# EAGLE schematic Driver_Breakout (EAGLE 7.2.0)
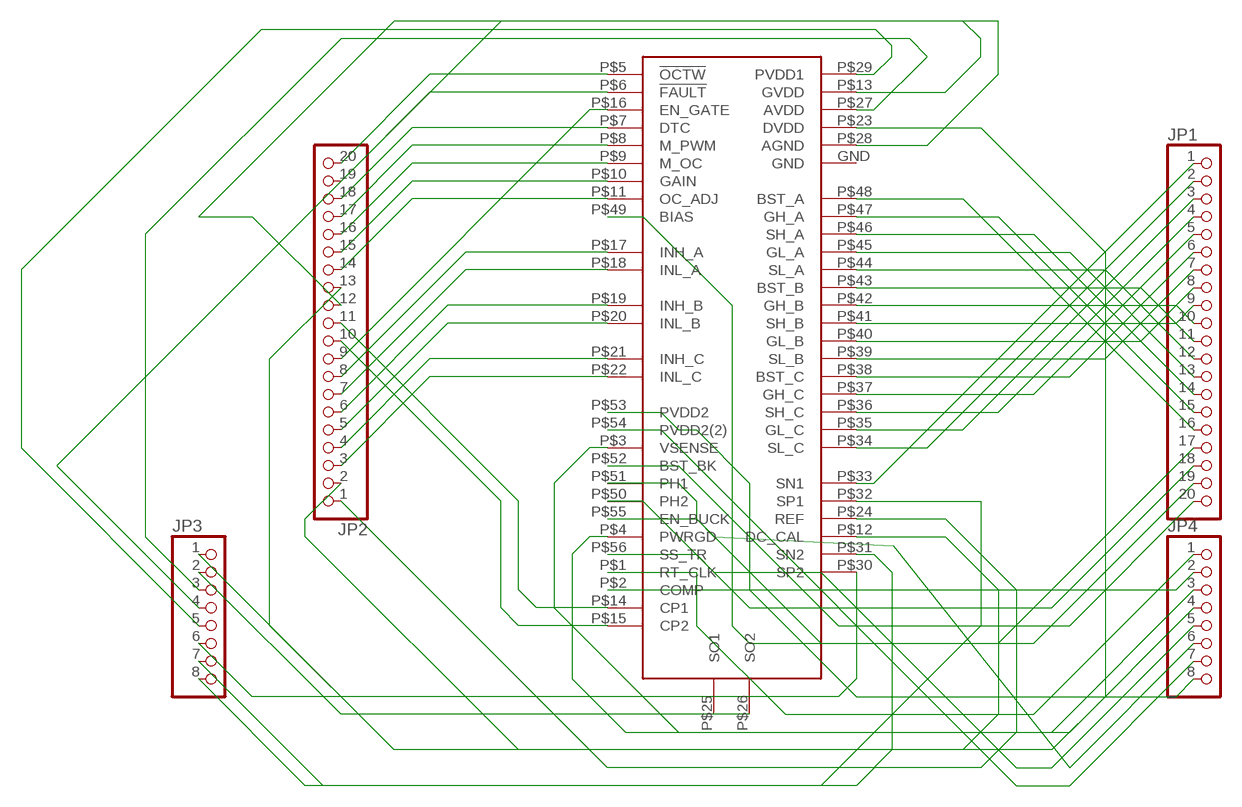
[diagram p0: schematic, sheet 1]

## Parts
JP1  PINHD-1X20  [1X20]
JP2  PINHD-1X20  [1X20]
JP3  PINHD-1X8BIG  [1X08-BIG]
JP4  PINHD-1X8BIG  [1X08-BIG]
U$1  DRV8302  [DRV8302]

## Nets
N$1: JP2.20 U$1.P$5(!OCTW)
N$2: JP2.19 U$1.P$6(!FAULT)
N$3: JP2.18 U$1.P$7(DTC)
N$4: JP2.17 U$1.P$8(M_PWM)
N$5: JP2.16 U$1.P$9(M_OC)
N$6: JP2.15 U$1.P$10(GAIN)
N$7: JP2.14 U$1.P$11(OC_ADJ)
N$8: JP2.13 U$1.P$12(DC_CAL)
N$9: JP2.12 U$1.P$13(GVDD)
N$10: JP2.11 U$1.P$14(CP1)
N$11: JP2.10 U$1.P$15(CP2)
N$12: JP2.9 U$1.P$16(EN_GATE)
N$13: JP2.8 U$1.P$17(INH_A)
N$14: JP2.7 U$1.P$18(INL_A)
N$15: JP2.6 U$1.P$19(INH_B)
N$16: JP2.5 U$1.P$20(INL_B)
N$17: JP2.4 U$1.P$21(INH_C)
N$18: JP2.3 U$1.P$22(INL_C)
N$19: JP2.2 U$1.P$23(DVDD)
N$20: JP2.1 U$1.P$24(REF)
N$21: JP3.1 U$1.P$25(SO1)
N$22: JP3.2 U$1.P$26(SO2)
N$23: JP4.1 U$1.P$1(RT_CLK)
N$24: JP4.2 U$1.P$2(COMP)
N$25: JP4.4 U$1.P$4(PWRGD)
N$26: JP4.3 U$1.P$3(VSENSE)
N$27: JP3.3 U$1.P$27(AVDD)
N$28: JP3.4 U$1.P$28(AGND)
N$29: JP4.5 U$1.P$56(SS_TR)
N$30: JP4.6 U$1.P$55(EN_BUCK)
N$31: JP4.7 U$1.P$54(PVDD2(2))
N$32: JP4.8 U$1.P$53(PVDD2)
N$33: JP1.20 U$1.P$52(BST_BK)
N$34: JP1.19 U$1.P$51(PH1)
N$35: JP1.18 U$1.P$50(PH2)
N$36: JP1.17 U$1.P$49(BIAS)
N$37: JP1.16 U$1.P$48(BST_A)
N$38: JP1.15 U$1.P$47(GH_A)
N$39: JP1.14 U$1.P$46(SH_A)
N$40: JP1.13 U$1.P$45(GL_A)
N$41: JP1.12 U$1.P$44(SL_A)
N$42: JP1.11 U$1.P$43(BST_B)
N$43: JP1.10 U$1.P$42(GH_B)
N$44: JP1.9 U$1.P$41(SH_B)
N$45: JP1.8 U$1.P$40(GL_B)
N$46: JP1.7 U$1.P$39(SL_B)
N$47: JP1.6 U$1.P$38(BST_C)
N$48: JP1.5 U$1.P$37(GH_C)
N$49: JP1.4 U$1.P$36(SH_C)
N$50: JP1.3 U$1.P$35(GL_C)
N$51: JP1.2 U$1.P$34(SL_C)
N$52: JP1.1 U$1.P$33(SN1)
N$53: JP3.8 U$1.P$32(SP1)
N$54: JP3.7 U$1.P$31(SN2)
N$55: JP3.6 U$1.P$30(SP2)
N$56: JP3.5 U$1.P$29(PVDD1)
Unconnected: U$1.GND

## Library data of the parts
JP1 JP2 = adafruit:PINHD-1X20: PIN HEADER
JP3 JP4 = adafruit:PINHD-1X8: PIN HEADER
U$1 = bldc_lib:DRV8302: DRV8302 3-Phase Brushless Motor Pre-Driver with Dual Current Sense Amps and Buck Converter (PWM Ctrl)